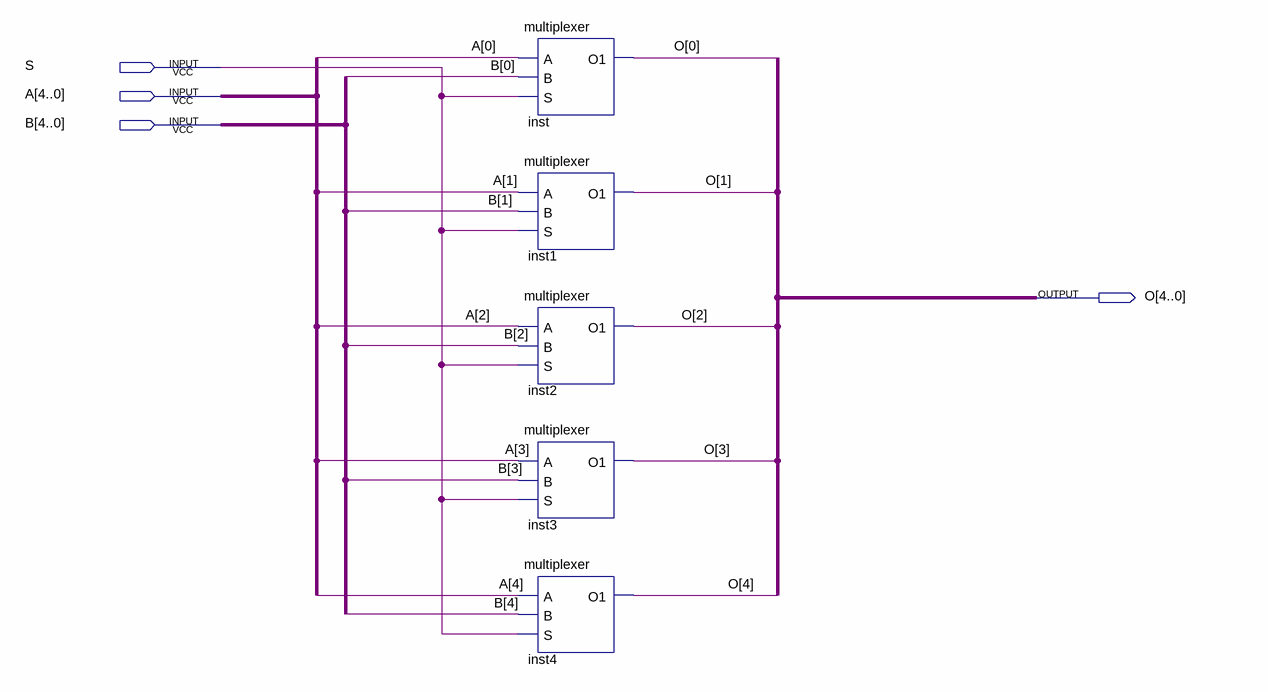
[diagram p0: schematic sheet]
// Quartus schematic fivemulti.bdf as structural Verilog: 5 symbols, 4 pins
module fivemulti (
  input  S,
  input  [4:0] A,
  input  [4:0] B,
  output [4:0] O
);

  multiplexer inst (.A(A[0]), .B(B[0]), .S(S), .O1(O[0]));
  multiplexer inst1 (.A(A[1]), .B(B[1]), .S(S), .O1(O[1]));
  multiplexer inst2 (.A(A[2]), .B(B[2]), .S(S), .O1(O[2]));
  multiplexer inst3 (.A(A[3]), .B(B[3]), .S(S), .O1(O[3]));
  multiplexer inst4 (.A(A[4]), .B(B[4]), .S(S), .O1(O[4]));
endmodule
